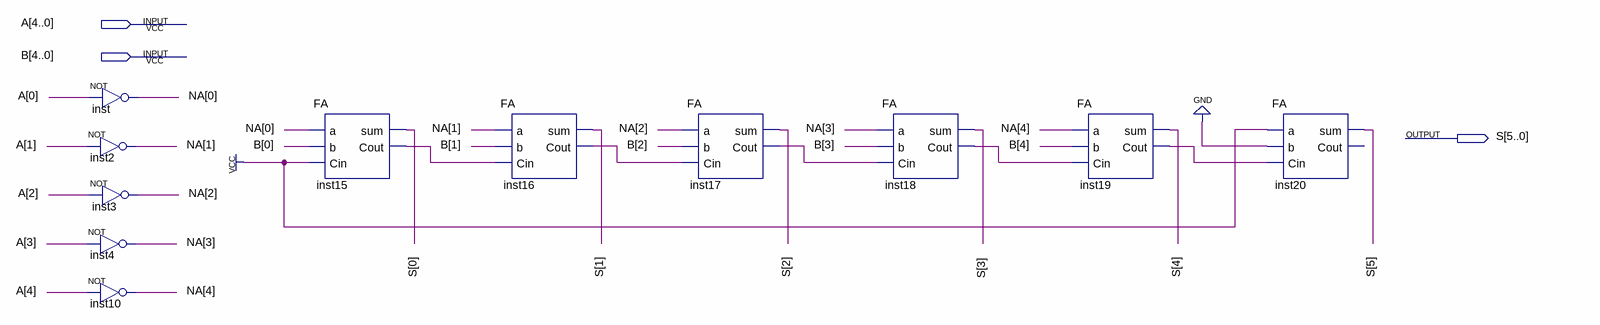
[diagram p0: schematic sheet]
// Quartus schematic 5bsubber.bdf as structural Verilog: 11 symbols, 3 pins
module \5bsubber  (
  input  [4:0] A,
  input  [4:0] B,
  output [5:0] S
);

  wire inst15_cout, inst16_cout, inst17_cout, inst18_cout, inst19_cout;
  wire [4:0] NA;

  not inst (NA[0], A[0]);
  not inst2 (NA[1], A[1]);
  not inst3 (NA[2], A[2]);
  not inst4 (NA[3], A[3]);
  not inst10 (NA[4], A[4]);
  FA inst15 (.a(NA[0]), .b(B[0]), .Cin(1'b1), .sum(S[0]), .Cout(inst15_cout));
  FA inst16 (.a(NA[1]), .b(B[1]), .Cin(inst15_cout), .sum(S[1]), .Cout(inst16_cout));
  FA inst17 (.a(NA[2]), .b(B[2]), .Cin(inst16_cout), .sum(S[2]), .Cout(inst17_cout));
  FA inst18 (.a(NA[3]), .b(B[3]), .Cin(inst17_cout), .sum(S[3]), .Cout(inst18_cout));
  FA inst19 (.a(NA[4]), .b(B[4]), .Cin(inst18_cout), .sum(S[4]), .Cout(inst19_cout));
  FA inst20 (.a(1'b1), .b(1'b0), .Cin(inst19_cout), .sum(S[5]));  // open: Cout
endmodule
